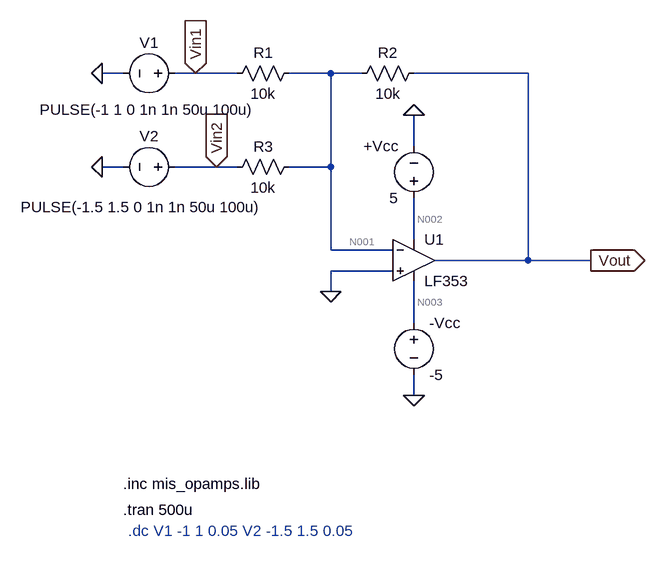
[diagram p0: schematic LF353.asc]
LF353.asc, the LTspice schematic file:
Version 4.1
SHEET 1 880 680
WIRE -144 -80 -176 -80
WIRE -32 -80 -64 -80
WIRE 32 -80 -32 -80
WIRE 176 -80 112 -80
WIRE 224 -80 176 -80
WIRE 480 -80 304 -80
WIRE 304 32 304 -16
WIRE -144 64 -176 64
WIRE 0 64 -64 64
WIRE 32 64 0 64
WIRE 176 64 176 -80
WIRE 176 64 112 64
WIRE 304 176 304 112
WIRE 176 192 176 64
WIRE 272 192 176 192
WIRE 480 208 480 -80
WIRE 480 208 336 208
WIRE 576 208 480 208
WIRE 272 224 176 224
WIRE 176 256 176 224
WIRE 304 304 304 240
WIRE 304 416 304 384
FLAG 304 -16 0
FLAG 304 416 0
FLAG 176 256 0
FLAG 576 208 Vout
IOPIN 576 208 Out
FLAG -176 -80 0
FLAG -176 64 0
FLAG -32 -80 Vin1
IOPIN -32 -80 In
FLAG 0 64 Vin2
IOPIN 0 64 In
SYMBOL res 128 -96 R90
WINDOW 0 0 56 VBottom 2
WINDOW 3 32 56 VTop 2
SYMATTR InstName R1
SYMATTR Value 10k
SYMBOL res 320 -96 R90
WINDOW 0 0 56 VBottom 2
WINDOW 3 32 56 VTop 2
SYMATTR InstName R2
SYMATTR Value 10k
SYMBOL OpAmps\\opamp2 304 144 R0
SYMATTR InstName U1
SYMATTR Value LF353
SYMBOL voltage 304 128 R180
WINDOW 0 24 96 Left 2
WINDOW 3 24 16 Left 2
SYMATTR InstName +Vcc
SYMATTR Value 5
SYMBOL voltage 304 288 R0
WINDOW 123 0 0 Left 0
WINDOW 39 0 0 Left 0
SYMATTR InstName -Vcc
SYMATTR Value -5
SYMBOL voltage -48 -80 R90
WINDOW 0 -32 56 VBottom 2
WINDOW 3 40 58 VTop 2
WINDOW 123 0 0 Left 0
WINDOW 39 0 0 Left 0
SYMATTR InstName V1
SYMATTR Value PULSE(-1 1 0 1n 1n 50u 100u)
SYMBOL res 128 48 R90
WINDOW 0 0 56 VBottom 2
WINDOW 3 32 56 VTop 2
SYMATTR InstName R3
SYMATTR Value 10k
SYMBOL voltage -48 64 R90
WINDOW 0 -32 56 VBottom 2
WINDOW 3 46 67 VTop 2
WINDOW 123 0 0 Left 0
WINDOW 39 0 0 Left 0
SYMATTR InstName V2
SYMATTR Value PULSE(-1.5 1.5 0 1n 1n 50u 100u)
TEXT -144 552 Left 2 !.inc mis_opamps.lib
TEXT -144 592 Left 2 !.tran 500u
TEXT -136 624 Left 2 ;.dc V1 -1 1 0.05 V2 -1.5 1.5 0.05

The netlist it stands for:
* LF353.asc
R1 N001 Vin1 10k
R2 Vout N001 10k
X§U1 0 N001 N002 N003 Vout LF353  ; pins In+ In- V+ V- OUT
V§+Vcc N002 0 5
V§-Vcc N003 0 -5
V1 Vin1 0 PULSE(-1 1 0 1n 1n 50u 100u)
R3 N001 Vin2 10k
V2 Vin2 0 PULSE(-1.5 1.5 0 1n 1n 50u 100u)
.inc mis_opamps.lib
.tran 500u
* .dc V1 -1 1 0.05 V2 -1.5 1.5 0.05
.backanno
.end

* Results of the author's LTspice run, read from the files saved beside the schematic
* Operating Point, zero values left out:
*   V(n001) = -22.59 µV
*   V(n002) = 5 V
*   V(n003) = -5 V
*   V(vin1) = -1 V
*   V(vin2) = -1.5 V
*   V(vout) = 2.5 V
*   I(+Vcc) = -861.7 µA
*   I(-Vcc) = 862 µA
*   I(R1) = 100 µA
*   I(R2) = 250 µA
*   I(R3) = 150 µA
*   I(V1) = 100 µA
*   I(V2) = 150 µA
*   Ix(u1:1) = 30.03 pA
*   Ix(u1:2) = 30.03 pA
*   Ix(u1:3) = 861.7 µA
*   Ix(u1:4) = -862 µA
*   Ix(u1:5) = -250 µA
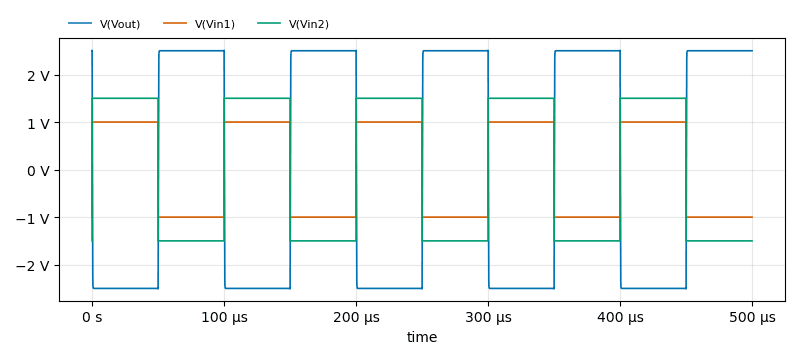
[diagram p1: Transient Analysis of LF353.asc, plotted from the saved traces]
* Transient Analysis, 1 run:
*   V(Vout): min -2.508 V, max 2.508 V, average 16.28 µV, rms 2.492 V, last 2.5 V
*   V(Vin1): min -1 V, max 1 V, average 20 µV, rms 1 V, last -1 V
*   V(Vin2): min -1.5 V, max 1.5 V, average 30 µV, rms 1.5 V, last -1.5 V